# Altium schematic sheet Microcontroller.SchDoc
size A; SheetNumber: 3; SheetTotal: 3
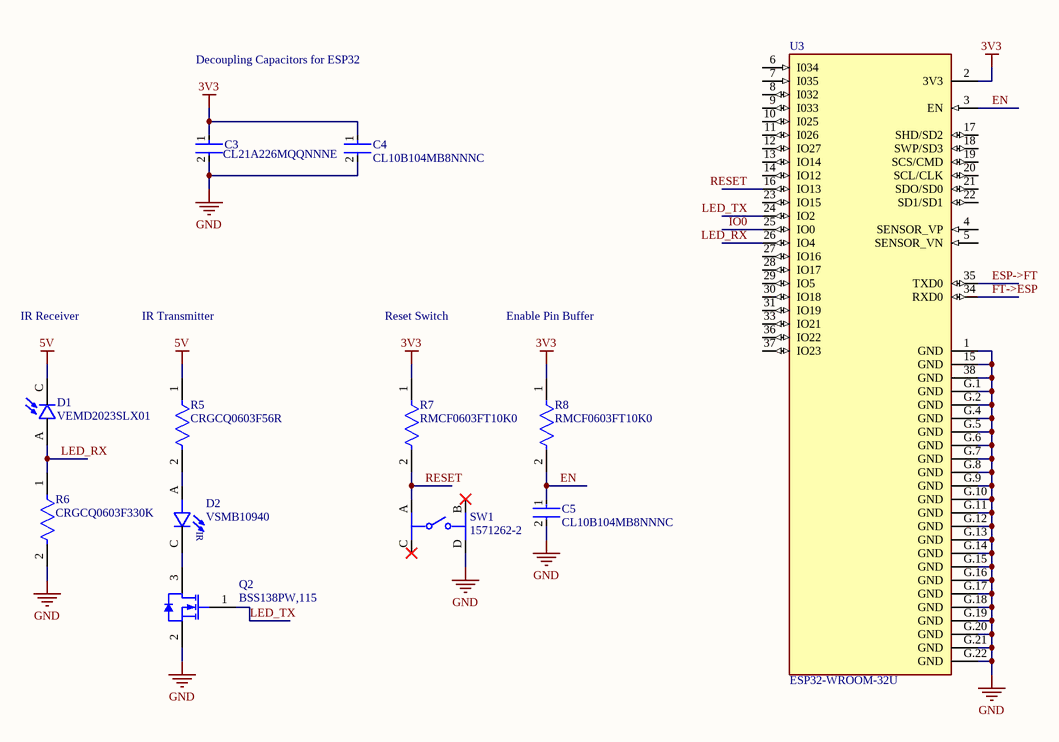
[diagram p0: Microcontroller.SchDoc]

## Parts
C3  CL21A226MQQNNNE  [FP-CL21-IPC_A]
C4  CL10B104MB8NNNC  [FP-CL10-IPC_C]
C5  CL10B104MB8NNNC  [FP-CL10-IPC_C]
D1  VEMD2023SLX01  [XDCR_VEMD2023SLX01]
D2  VSMB10940  [DIO_VSMB10940]
Q2  BSS138PW,115  [NXP-SOT323_M]
R5  CRGCQ0603F56R  [FP-CRGCQ0603-IPC_C]
R6  CRGCQ0603F330K  [FP-CRGCQ0603-IPC_C]
R7  RMCF0603FT10K0  [FP-RMCF0603-MFG]
R8  RMCF0603FT10K0  [FP-RMCF0603-MFG]
SW1  1571262-2  [FP-1571262-2-MFG]
U3  ESP32-WROOM-32U  [XCVR_ESP32-WROOM-32U]

## Nets
3V3: C3.1 C4.1 R7.1 R8.1 U3.2(3V3)
5V: D1.C R5.1
GND: C3.2 C4.2 C5.2 Q2.2(S) R6.2 SW1.D U3.1(GND) U3.15(GND) U3.38(GND) U3.G.1(GND) U3.G.2(GND) U3.G.4(GND) U3.G.5(GND) U3.G.6(GND) U3.G.7(GND) U3.G.8(GND) U3.G.9(GND) U3.G.10(GND) U3.G.11(GND) U3.G.12(GND) U3.G.13(GND) U3.G.14(GND) U3.G.15(GND) U3.G.16(GND) U3.G.17(GND) U3.G.18(GND) U3.G.19(GND) U3.G.20(GND) U3.G.21(GND) U3.G.22(GND)
EN: C5.1 R8.2 U3.3(EN)
ESP->FT: U3.35(TXD0)
FT->ESP: U3.34(RXD0)
IO0: U3.25(IO0)
LED_RX: D1.A R6.1 U3.26(IO4)
LED_TX: Q2.1(G) U3.24(IO2)
RESET: R7.2 SW1.A U3.16(IO13)
NetD2_A: D2.A R5.2
NetD2_C: D2.C Q2.3(D)

Not connected (* = marked no-connect by the designer): SW1 B* C*; U3 4(SENSOR_VP) 5(SENSOR_VN) 6(I034) 7(I035) 8(I032) 9(I033) 10(I025) 11(I026) 12(IO27) 13(IO14) 14(IO12) 17(SHD/SD2) 18(SWP/SD3) 19(SCS/CMD) 20(SCL/CLK) 21(SDO/SD0) 22(SD1/SD1) 23(IO15) 27(IO16) 28(IO17) 29(IO5) 30(IO18) 31(IO19) 33(IO21) 36(IO22) 37(IO23)

## Notes on the sheet
- Decoupling Capacitors for ESP32
- IR Receiver
- IR Transmitter
- Reset Switch
- Enable Pin Buffer
- (in symbol VSMB10940) IR

## Library data of the parts
C3 = CMP-13271-000185-1: CL21 Series 0805 22uF 6.3V ±20% Tolerance X5R Multilayer Ceramic Chip Capacitor; Height: 1.25mm; Length: 2mm; Capacitance: 22uF; Mount: Surface Mount; Dielectric: X5R; Voltage Rating (DC): 6.3V; Case Code (Metric): 2012; Depth: 1.25mm; Max Operating Temperature: 85°C; Voltage Rating: 6.3V; Width: 0.049inch; Case/Package: 0805; Radiation Hardening: No; Thickness: 0.055inch; Packaging: Tape and Reel; Package Quantity: 2000; Lead Free: Lead Free; Contact Plating: Tin; Min Operating Temperature: -55°C; Case Code (Imperial): 0805; Tolerance: 20%
C4 C5 = CMP-13271-001724-1: Cap Ceramic 100nF 50V X7R ±20% Pad SMD 0603 +125°C T/R; Mount: Surface Mount; Lead Free: Lead Free; Max Operating Temperature: 125°C; Voltage Rating: 50V; Case Code (Imperial): 0603; Capacitance: 100nF; Height: 0.8mm; Length: 1.6mm; Tolerance: 20%; Case Code (Metric): 1608; Thickness: 0.035inch; Depth: 0.8mm; Width: 0.031inch; Package Quantity: 1; Min Operating Temperature: -55°C; Case/Package: 0603; Radiation Hardening: No; Voltage Rating (DC): 50V; Dielectric: X7R; Packaging: Tape and Reel
D1 = VEMD2023SLX01: MF: {'manufacturer': u'Vishay Semiconductor'}; Value: *; Package: None; MP: VEMD2023SLX01; Price: None; Availability: Unavailable
D2 = VSMB10940: 940 nm 65 mA Â±75Â° Surface Mount High Speed Infrared Emitting Diode; MF: {'manufacturer': u'Vishay Semiconductor'}; Value: *; Package: None; MP: VSMB10940; Price: None; Availability: Unavailable
Q2 = CMP-1259-00109-1: N-Channel Trench MOSFET, 60 V, 0.32 A, -55 to 150 degC, 3-Pin SOT323, Tape and Reel; Manufacturer: NXP Semiconductors; IDM [max] (A): 1.2; ID [max] (A): 0.32; Automotive Qualified: Y; Channel Type: N; VDS [max] (V): 60; Packing: Tape & Reel; DatasheetVersion: Rev. 1; PartNumber: BSS138PW,115; ComponentLink2URL: http://www.nxp.com/documents/data_sheet/BSS138PW.pdf; ComponentLink3Description: Package Specification; PackageReference: SOT323; PackageDescription: 3-Pin Small Outline Transistor Package, Body 2 x 1.25 mm, Pitch 0.65 mm; Code_JEITA: SC-70; ComponentLink3URL: http://www.nxp.com/documents/outline_drawing/sot323_po.pdf; ComponentLink1URL: http://www.nxp.com/; ComponentLink2Description: Datasheet; PackageVersion: 06-03-16, 03/2006; Mounting Technology: Surface Mount; ComponentLink1Description: Manufacturer URL; VGSth [typ] (V): 1.2
R5 = CMP-03211-009681-1: CRGCQ0603 56Ω 1% ±200ppm/°C 75V; Manufacturer: TE Connectivity; Tolerance: 0.01; Power Rating: 0.1W; Temperature Coefficient: ±200ppm/°C; Package: CRGCQ0603; Value: 56Ω; Temperature Range Low: -55°C; Composition: Thick Film; Series: CRGCQ; ComponentLink2Description: Datasheet; ComponentLink2URL: https://www.te.com/commerce/DocumentDelivery/DDEController?Action=showdoc&DocId=Data+Sheet%7F1773204-3%7F1%7Fpdf%7FEnglish%7FENG_DS_1773204-3_1.pdf%7F4-2176339-408; Category: Res; Temperature Range High: +155°C; Octopart: https://octopart.com/crgcq0603f56r-te+connectivity-91018083; RoHS: TRUE; Height: 0.55mm; Lead Free: Yes; Resistance: 56Ω; Device Class L3: Chip SMD Resistors; Ipc Land Pattern Name: RESC16080X45; Ambient Temperature Range High: +70°C; Device Class L1: Passive Components; Device Class L2: Resistors; Temperature: -55°C to +155°C; Voltage Rating: 75V; Manufacturer Part Number: CRGCQ0603F56R
R6 = CMP-03211-011074-1: Res Thick Film 0603 330K Ohm 1% 0.1W(1/10W) ±100ppm/C Pad SMD Automotive T/R; Manufacturer: TE Connectivity; Temperature Coefficient: ±100ppm/°C; Tolerance: 0.01; Value: 330KΩ; Voltage Rating: 75V; Temperature Range Low: -55°C; ComponentLink2Description: Datasheet; Ambient Temperature Range High: +70°C; Composition: Thick Film; ComponentLink2URL: https://www.te.com/commerce/DocumentDelivery/DDEController?Action=showdoc&DocId=Data+Sheet%7F1773204-3%7F1%7Fpdf%7FEnglish%7FENG_DS_1773204-3_1.pdf%7F4-2176339-1264; Octopart: https://octopart.com/crgcq0603f330k-te+connectivity-91018065; Category: Res; RoHS: TRUE; Manufacturer Part Number: CRGCQ0603F330K; Device Class L2: Resistors; Resistance: 330KΩ; Digikey Description: Res Thick Film 0603 330K Ohm 1% 0.1W(1/10W) ±100ppm/C Pad SMD Automotive T/R; Height: 0.55mm; Ipc Land Pattern Name: RESC16080X45; Power Rating: 0.1W; Temperature: -55°C to +155°C; Series: CRGCQ; Package: CRGCQ0603; Temperature Range High: +155°C; Device Class L3: Chip SMD Resistors; Lead Free: Yes; Device Class L1: Passive Components
R7 R8 = CMP-2000-06990-2: 10kΩ ±1% 0.1W 0603 Thick Film Chip Resistor AEC-Q200 compliant; Max Power Dissipation: 100mW; Resistance: 10kR; Temperature Coefficient: 100ppm/°C; Military Standard: Not; Mount: Surface Mount; Depth: 0.8mm; Height: 0.022inch; Size Code: 0603; Case/Package: 0603; Resistor Type: Thick Film; Min Operating Temperature: -55°C; Length: 1.55mm; Construction: Rectangular; Case Code (Imperial): 0603; Packaging: Tape and Reel; Radiation Hardening: No; Power Rating: 100mW; Max Operating Temperature: 155°C; Contact Plating: Tin; Case Code (Metric): 1608; Lead Free: Lead Free; Series: RMCF; Tolerance: 1%; Features: Automotive AEC-Q200; Number of Terminations: 2; RoHS Compliant: Yes; Width: 0.031inch
SW1 = CMP-03402-000034-1: SWITCH TACTILE SPST-NO 0.05A 12V; Max Current Rating: 50mA; Illumination Type: Non-Illuminated; Mechanical Life: 50000Cycles; Throw Configuration: SPST; Operating Force: 1.6N; Switch Function: Off-Mom; Actuator Color: Black; Actuator Length: 0.055inch; Actuator Material: Liquid Crystal Polymer; Mount: Surface Mount; RoHS Compliant: Yes; Case/Package: SMD/SMT; Termination: Gull Wing; Voltage Rating (DC): 12V; Radiation Hardening: No; Package Quantity: 1; Min Operating Temperature: -20°C; Contact Material: Stainless Steel; Type: Switch; Contact Current Rating: 50mA; Material: Nylon; Current Rating: 50mA; Orientation: Right Angle; ELV: Compliant; Housing Material: Nylon; Depth: 7.15mm; Contact Plating: Silver; Max Operating Temperature: 85°C; Packaging: Tape and Reel; Length: 5.4mm; Max Voltage Rating (DC): 12V; Series: Alcoswitch
U3 = ESP32-WROOM-32U: Wi-Fi/BT BLE Module ESP32-D0WD SPI Flash UART U.FL Conn.; MF: {'manufacturer': u'Espressif Systems'}; Value: *; Package: None; MP: ESP32-WROOM-32U; Price: None; Availability: Unavailable